# EAGLE design untitled (EAGLE 9.6.2)
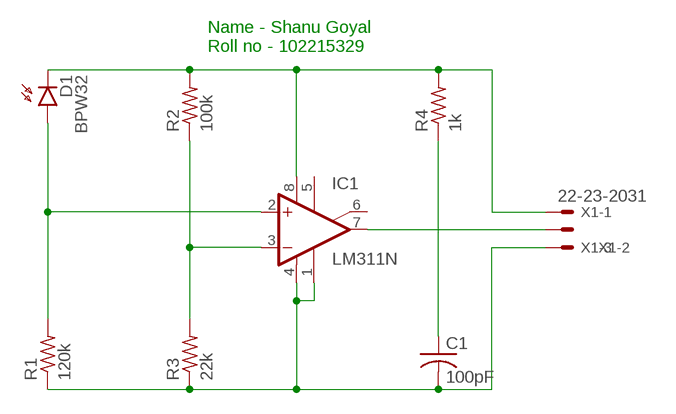
[diagram p0: schematic, sheet 1]

## Parts
C1  100pF  C-US025-050X050  [C025-050X050]
D1  BPW32  [BPW32]
IC1  LM311N  [DIL08]
R1  120k  R-US_0204/5  [0204/5]
R2  100k  R-US_0204/5  [0204/5]
R3  22k  R-US_0204/5  [0204/5]
R4  1k  R-US_0204/5  [0204/5]
X1  22-23-2031  [22-23-2031]

## Nets
N$1: D1.K(C) IC1.8(V+) R2.2 R4.2 X1.1
N$2: C1.2 IC1.1(GND) IC1.4(V-) R1.1 R3.1 X1.3
N$3: IC1.7(OUT) X1.2
N$4: C1.1 R4.1
N$6: IC1.3(-IN) R2.1 R3.2
N$7: D1.A IC1.2(+IN) R1.2
Unconnected: IC1.5(ON) IC1.6(ON/STR)

## Notes on the sheet
- Name - Shanu Goyal 
  Roll no - 102215329

## Library data of the parts
C1 = rcl:C-US: CAPACITOR, American symbol; SPICEPREFIX: C
D1 = opto-trans-siemens:BPW32: PHOTO DIODE; OC_FARNELL: unknown; OC_NEWARK: unknown
IC1 = linear:LM311: COMPARATOR
R1-R4 = rcl:R-US_: RESISTOR, American symbol; SPICEPREFIX: R
X1 = con-molex:22-23-2031: .100" (2.54mm) Center Header - 3 Pin; MF: MOLEX; MPN: 22-23-2031; OC_FARNELL: 1462950; OC_NEWARK: 30C0862

## Board
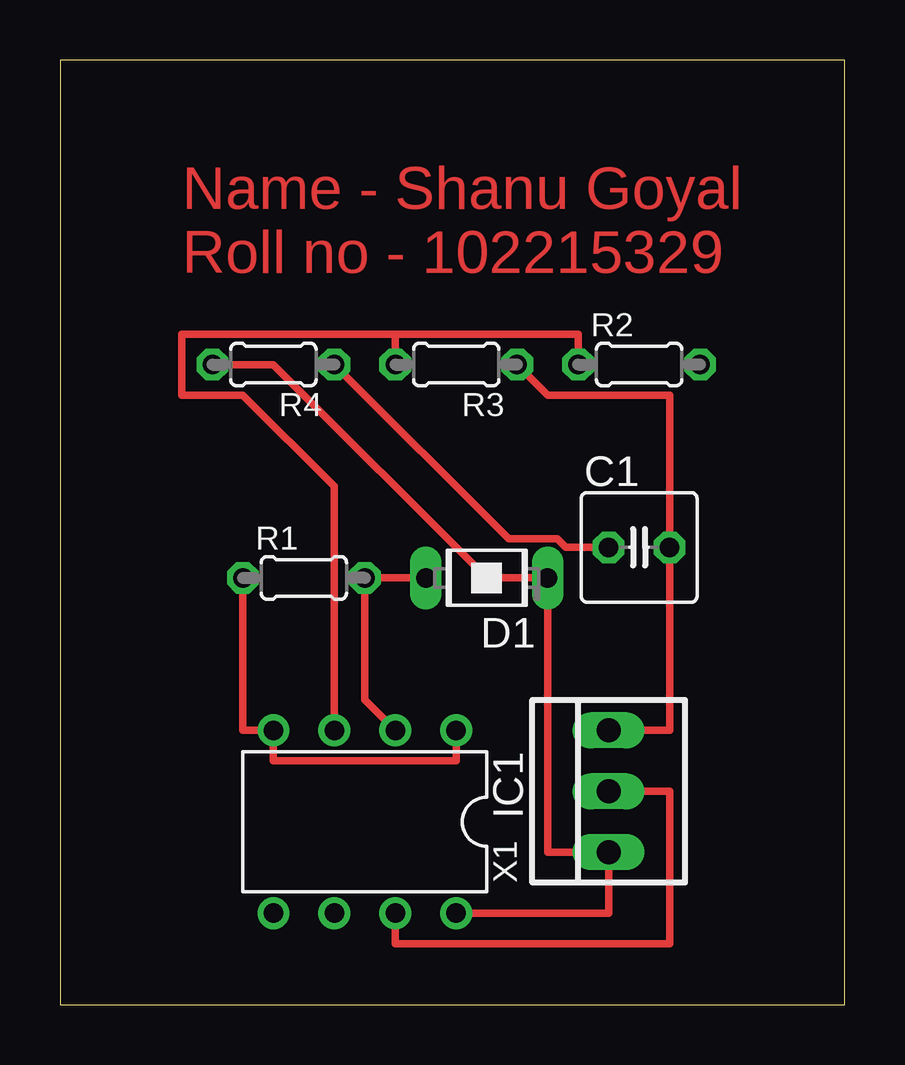
[diagram p1: board, top side]
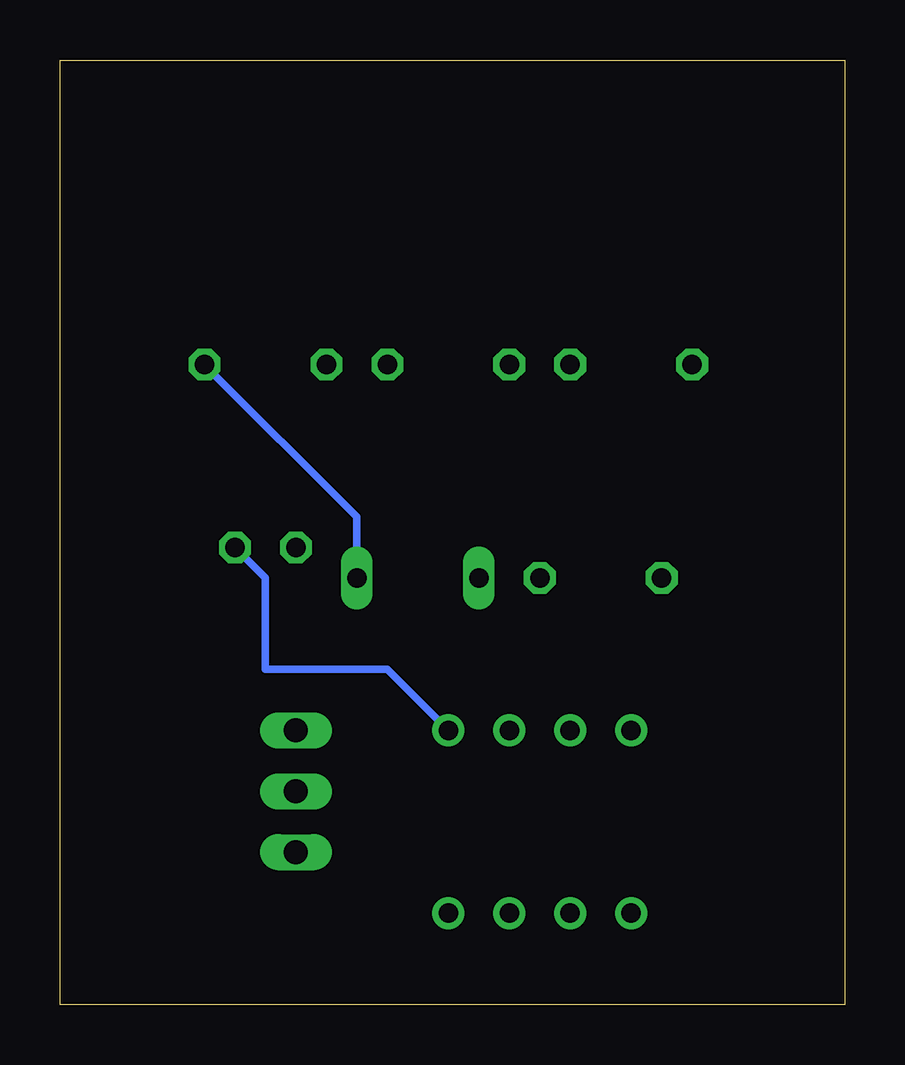
[diagram p2: board, bottom side, seen from below]

Size 32.69 x 39.36 mm. Coordinates in mm from the lower left corner, seen from the top.
Outline: 0,0 32.69,0 32.69,39.36 0,39.36 0,0
Copper layers (1*16): Top 0.035mm / dielectric 1.5mm / Bottom 0.035mm
Design rules "default": minimum track width 6mil, minimum drill 0.35mm, track to track 6mil, track to pad 6mil, pad to pad 6mil, via to via 6mil, smd to smd 6mil, copper to edge 40mil, drill to drill 6mil, minimum pad ring 10mil, minimum via ring 8mil, stop-mask expansion 4mil, vias tented up to drill 0mil, thermal gap 10mil

### Footprints (pad centres in the part's own frame; a part is rotated, then mirrored left to right if it is on the bottom)
C025-050X050 = drill 0.813 octagon: 1 -1.27,0; 2 1.27,0
BPW32 = drill 0.813 long: A 0,2.54; K 0,-2.54
DIL08 = drill 0.813 pad 1.27: 1 -3.81,-3.81; 2 -1.27,-3.81; 3 1.27,-3.81; 4 3.81,-3.81; 5 3.81,3.81; 6 1.27,3.81; 7 -1.27,3.81; 8 -3.81,3.81
0204/5 = drill 0.813 octagon: 1 -2.54,0; 2 2.54,0
22-23-2031 = drill 1 long: 1 -2.54,0; 2 0,0; 3 2.54,0

### Placement (x,y rotation side)
C1  24.13,19.05 0 top
D1  17.78,17.78 90 top
IC1  12.7,7.62 180 top
R1  10.16,17.78 0 top
R2  24.13,26.67 0 top
R3  16.51,26.67 180 top
R4  8.89,26.67 180 top
X1  22.86,8.89 90 top

### Tracks (layer width: path | path; a pad name or v marks a point on that pad's centre or on a via)
N$1
  Top 0.305: IC1.8 22.86,3.81 X1.1 20.32,6.35 D1.K 17.78,17.78 8.89,26.67 R4.2
  Bottom 0.305: D1.K 20.32,20.32 R2.2
N$2
  Top 0.305: X1.3 25.4,11.43 C1.2 25.4,25.4 20.32,25.4 R3.1 | R1.1 7.62,11.43 IC1.4 8.89,10.16 16.51,10.16 IC1.1
  Bottom 0.305: IC1.1 19.05,13.97 24.13,13.97 24.13,17.78 C1.2
N$3
  Top 0.305: IC1.7 13.97,2.54 25.4,2.54 25.4,8.89 X1.2
N$4
  Top 0.305: C1.1 21.07,19.05 20.72,19.41 18.69,19.41 R4.1
N$6
  Top 0.305: R2.1 21.59,27.94 13.97,27.94 | 13.97,27.94 R3.2 | 13.97,27.94 5.08,27.94 5.08,25.4 7.62,25.4 11.43,21.59 IC1.3
N$7
  Top 0.305: IC1.2 12.7,12.7 R1.2 D1.A

### Text on the board
Top: Name - Shanu Goyal / Roll no - 102215329